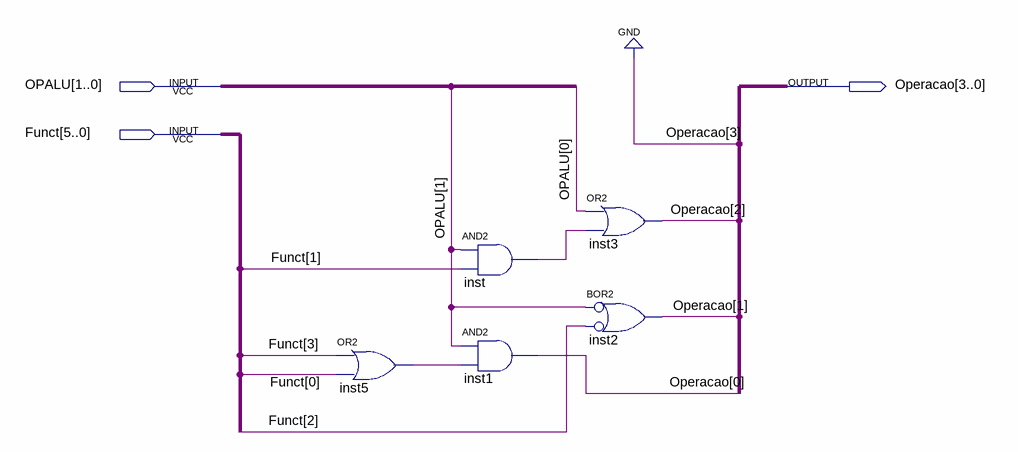
[diagram p0: schematic sheet]
// Quartus schematic controle_ULA.bdf as structural Verilog: 5 symbols, 3 pins
module controle_ULA (
  input  [1:0] OPALU,
  input  [5:0] Funct,
  output [3:0] Operacao
);

  wire inst5_out, inst_out;

  or inst5 (inst5_out, Funct[3], Funct[0]);
  and inst (inst_out, OPALU[1], Funct[1]);
  and inst1 (Operacao[0], OPALU[1], inst5_out);
  or inst3 (Operacao[2], OPALU[0], inst_out);
  or inst2 (Operacao[1], ~OPALU[1], ~Funct[2]);  // BOR2

  assign Operacao[3] = 1'b0;
endmodule
